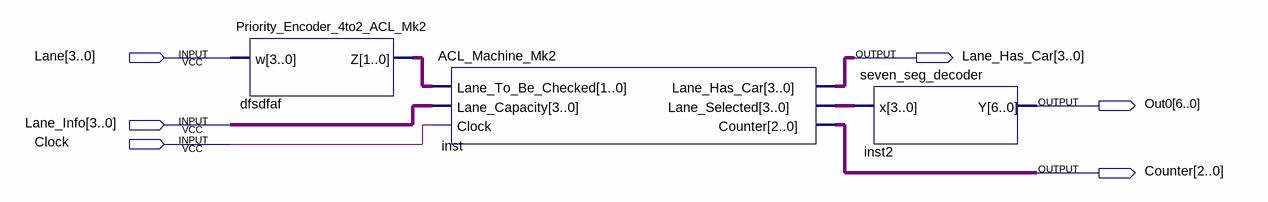
[diagram p0: schematic sheet]
// Quartus schematic ACL_Mk2_Test.bdf as structural Verilog: 3 symbols, 6 pins
module ACL_Mk2_Test (
  input  [3:0] Lane,
  input  [3:0] Lane_Info,
  input  Clock,
  output [3:0] Lane_Has_Car,
  output [6:0] Out0,
  output [2:0] Counter
);

  wire [1:0] dfsdfaf_z;
  wire [3:0] inst_lane_selected;

  Priority_Encoder_4to2_ACL_Mk2 dfsdfaf (.w(Lane), .Z(dfsdfaf_z));
  ACL_Machine_Mk2 inst (
    .Lane_To_Be_Checked(dfsdfaf_z), .Lane_Capacity(Lane_Info), .Clock(Clock), .Lane_Has_Car(Lane_Has_Car),
    .Lane_Selected(inst_lane_selected), .Counter(Counter));
  seven_seg_decoder inst2 (.x(inst_lane_selected), .Y(Out0));
endmodule
